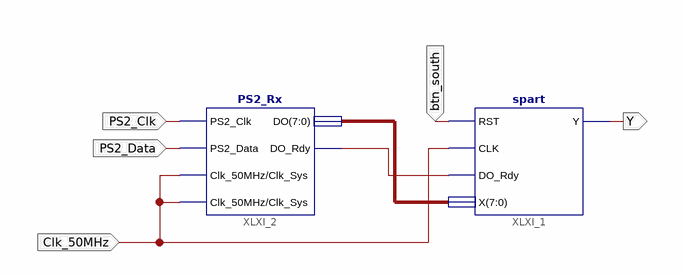
[diagram p0: schematic sheet 1]
// Xilinx ISE schematic spartan.sch (spartan3e) as structural Verilog: 2 symbols, 5 ports
module spartan (
  input  PS2_Data,
  input  PS2_Clk,
  input  Clk_50MHz,
  input  btn_south,
  output Y
);

  wire XLXN_5;
  wire [7:0] XLXN_4;

  spart XLXI_1 (.RST(btn_south), .CLK(Clk_50MHz), .DO_Rdy(XLXN_5), .X(XLXN_4), .Y(Y));
  PS2_Rx XLXI_2 (
    .PS2_Clk(PS2_Clk), .PS2_Data(PS2_Data), .Clk_50MHz(Clk_50MHz), .Clk_Sys(Clk_50MHz), .DO_Rdy(XLXN_5),
    .DO(XLXN_4));
endmodule
